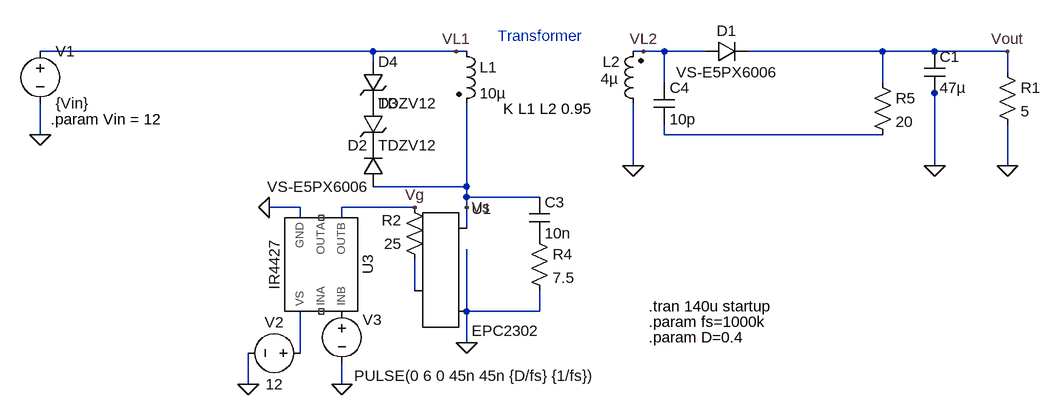
[diagram p0: schematic Flyback V2.asc]
Flyback V2.asc, the LTspice schematic file:
Version 4
SHEET 1 888 680
WIRE -224 -288 -736 -288
WIRE -96 -288 -224 -288
WIRE -80 -288 -96 -288
WIRE 192 -288 176 -288
WIRE 224 -288 192 -288
WIRE 288 -288 224 -288
WIRE 560 -288 352 -288
WIRE 640 -288 560 -288
WIRE 752 -288 640 -288
WIRE -224 -272 -224 -288
WIRE 752 -256 752 -288
WIRE 224 -240 224 -288
WIRE 560 -240 560 -288
WIRE 640 -224 640 -240
WIRE -736 -160 -736 -208
WIRE 224 -160 224 -176
WIRE 560 -160 224 -160
WIRE 176 -112 176 -208
WIRE 640 -112 640 -224
WIRE 752 -112 752 -176
WIRE -80 -80 -80 -208
WIRE -80 -80 -224 -80
WIRE -80 -64 -80 -80
WIRE 32 -64 -80 -64
WIRE -336 -48 -384 -48
WIRE -160 -48 -272 -48
WIRE -80 -48 -80 -64
WIRE -336 -32 -336 -48
WIRE -272 -32 -272 -48
WIRE -80 -16 -80 -48
WIRE -160 80 -160 32
WIRE -80 112 -80 16
WIRE 32 112 32 80
WIRE 32 112 -80 112
WIRE -80 160 -80 112
WIRE -336 176 -336 112
WIRE -416 224 -416 176
WIRE -272 224 -272 192
FLAG 176 -112 0
FLAG 752 -112 0
FLAG -80 160 0
FLAG -736 -160 0
FLAG 752 -288 Vout
FLAG -96 -288 VL1
FLAG 192 -288 VL2
FLAG -416 224 0
FLAG -384 -48 0
FLAG -272 224 0
FLAG -160 -48 Vg
FLAG -80 -48 Vs
FLAG 640 -112 0
SYMBOL ind2 -96 -304 R0
SYMATTR InstName L1
SYMATTR Value 10µ
SYMBOL ind2 192 -192 R180
WINDOW 0 36 80 Left 2
WINDOW 3 39 54 Left 2
SYMATTR InstName L2
SYMATTR Value 4µ
SYMBOL voltage -736 -304 R0
WINDOW 123 0 0 Left 0
WINDOW 39 24 44 Left 2
SYMATTR InstName V1
SYMATTR Value {Vin}
SYMBOL diode 288 -272 R270
WINDOW 0 32 32 VTop 2
WINDOW 3 0 32 VBottom 2
SYMATTR InstName D1
SYMATTR Value VS-E5PX6006
SYMBOL res 736 -272 R0
SYMATTR InstName R1
SYMATTR Value 5
SYMBOL EPCGaN -160 80 R0
SYMATTR InstName U1
SYMATTR Value EPC2302
SYMBOL voltage -320 176 R90
WINDOW 0 -32 56 VBottom 2
WINDOW 3 32 56 VTop 2
WINDOW 123 0 0 Left 0
WINDOW 39 0 0 Left 0
SYMATTR InstName V2
SYMATTR Value 12
SYMBOL voltage -272 96 R0
WINDOW 123 0 0 Left 0
WINDOW 39 0 0 Left 0
WINDOW 3 19 115 Left 2
WINDOW 0 32 29 Left 2
SYMATTR Value PULSE(0 6 0 45n 45n {D/fs} {1/fs})
SYMATTR InstName V3
SYMBOL IR4427 -304 32 R90
SYMATTR InstName U3
SYMBOL res -144 48 R180
WINDOW 0 36 76 Left 2
WINDOW 3 36 40 Left 2
SYMATTR InstName R2
SYMATTR Value 25
SYMBOL cap 624 -288 R0
SYMATTR InstName C1
SYMATTR Value 47µ
SYMBOL diode -208 -80 R180
WINDOW 0 24 64 Left 2
WINDOW 3 24 0 Left 2
SYMATTR InstName D2
SYMATTR Value VS-E5PX6006
SYMBOL cap 16 -64 R0
SYMATTR InstName C3
SYMATTR Value 10n
SYMBOL res 16 -16 R0
SYMATTR InstName R4
SYMATTR Value 7.5
SYMBOL cap 208 -240 R0
SYMATTR InstName C4
SYMATTR Value 10p
SYMBOL res 544 -256 R0
SYMATTR InstName R5
SYMATTR Value 20
SYMBOL zener -240 -208 R0
SYMATTR InstName D3
SYMATTR Value TDZV12
SYMATTR Description Diode
SYMATTR Type diode
SYMBOL zener -240 -272 R0
SYMATTR InstName D4
SYMATTR Value TDZV12
SYMATTR Description Diode
SYMATTR Type diode
TEXT -24 -200 Left 2 !K L1 L2 0.95
TEXT -720 -184 Left 2 !.param Vin = 12
TEXT 200 104 Left 2 !.tran 140u startup
TEXT 200 128 Left 2 !.param fs=1000k
TEXT 200 152 Left 2 !.param D=0.4
TEXT -32 -312 Left 2 ;Transformer

The netlist it stands for:
* Flyback V2.asc
L1 VL1 Vs 10µ
L2 0 VL2 4µ
V1 VL1 0 {Vin}
D1 VL2 Vout VS-E5PX6006
R1 Vout 0 5
XU1 N002 Vs 0 EPC2302
V2 N003 0 12
V3 P001 0 PULSE(0 6 0 45n 45n {D/fs} {1/fs})
XU3 Vg NC_01 0 P001 NC_02 N003 IR4427  ; pins OUTB OUTA GND INB INA VS
R2 N002 Vg 25
C1 Vout 0 47µ
D2 Vs P002 VS-E5PX6006
C3 Vs P003 10n
R4 P003 0 7.5
C4 VL2 N001 10p
R5 Vout N001 20
D3 P004 P002 TDZV12
D4 VL1 P004 TDZV12
.model D D
.lib standard.dio
K L1 L2 0.95
.param Vin = 12
.tran 140u startup
.param fs=1000k
.param D=0.4
* Transformer
.lib D:\Users\C1\Documents\C1_Repos\Technion_Project_A\LTSPICE\Components\Libraries\IR4427.lib
.backanno
.end